# EAGLE design schema (EAGLE 7.3.0)
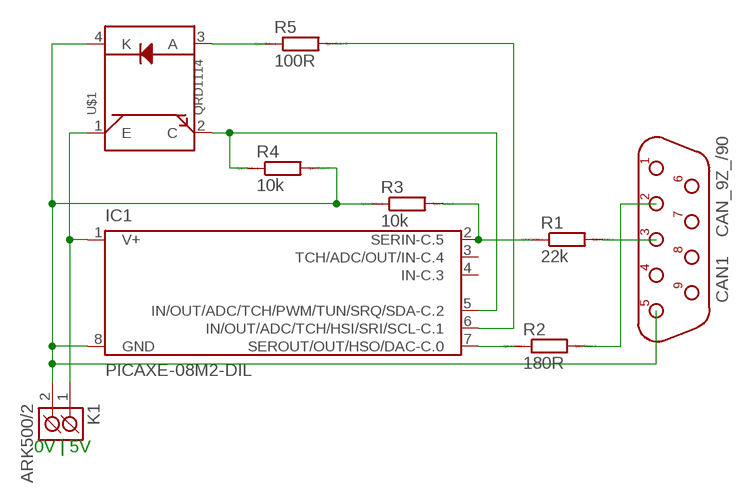
[diagram p0: schematic, sheet 1]

## Parts
CAN1  CAN_9Z_/90  [CAN9Z/90]
IC1  PICAXE-08M2-DIL  [DIL8]
K1  ARK500/2  [ARK500/2]
R1  22k  R0207/10  [0207/10]
R2  180R  R0207/10  [0207/10]
R3  10k  R0207/10  [0207/10]
R4  10k  R0207/10  [0207/10]
R5  100R  R0207/10  [0207/10]
U$1  QRD1114  [QRD1114]

## Nets
N$1: IC1.7(SEROUT/OUT/HSO/DAC-C.0) R2.1
N$2: CAN1.3 R1.2
N$3: CAN1.2 R2.2
N$4: R5.1 U$1.3(A)
N$5: IC1.6(IN/OUT/ADC/TCH/HSI/SRI/SCL-C.1) R5.2
N$6: IC1.5(IN/OUT/ADC/TCH/PWM/TUN/SRQ/SDA-C.2) R4.1 U$1.2(C)
N$7: CAN1.5 IC1.8(GND) K1.2(K2) R3.1 R4.2 U$1.4(K)
N$9: IC1.1(V+) K1.1(K1) U$1.1(E)
N$10: IC1.2(SERIN-C.5) R1.1 R3.2
Unconnected: CAN1.1 CAN1.4 CAN1.6 CAN1.7 CAN1.8 CAN1.9 IC1.3(TCH/ADC/OUT/IN-C.4) IC1.4(IN-C.3)

## Notes on the sheet
- 0V | 5V

## Library data of the parts
CAN1 = #PaJa_konektory:CAN_9Z: Konektory CANNON - zasuvka - 9pinu
IC1 = PICAXE:PICAXE-08M2: PICAXE chips come in two series – the M2 and X2 series – and 6 physical sizes (8, 14, 18, 20, 28, 40 pin). Feature 08M2 14M2 18M2 20M2 20X2 28X2 40X2 Memory Capacity(bytes) 2048 2048 x2 2048 x2 2048 x2 4096 4096 x4 4096 x4 RAM (bytes) 128 512 512 512 256 1280 1280 Byte Variables (bytes) 28 28 28 28 56 56 56 Input/Outputs Pins 6 12 16 18 18 22 33 ADC/Touch Pins 3 7 10 11 11 16 27 Max. Freq. (MHz) 32 32 32 32 64 64 64 Serial In/Out Yes Yes Yes Yes Yes Yes Yes Infrared In/Out Yes Yes Yes Yes Yes Yes Yes I2C Yes Yes Yes Yes Yes Yes Yes Tune (ring tones) Yes Yes Yes Yes Yes Yes Yes Parallel Tasks 4 8 8 8 1 1 1 Program Slots 1 2 2 2 1 4 4
K1 = #PaJa_konektory:ARK500/2: Svorkovnice - roztec 5mm - dvojita
R1-R5 = eagle-ltspice:R: RESISTOR, European symbol; SPICEMODEL: NONE; SPICEPREFIX: R
U$1 = SparkFun:QRD1114

## Board
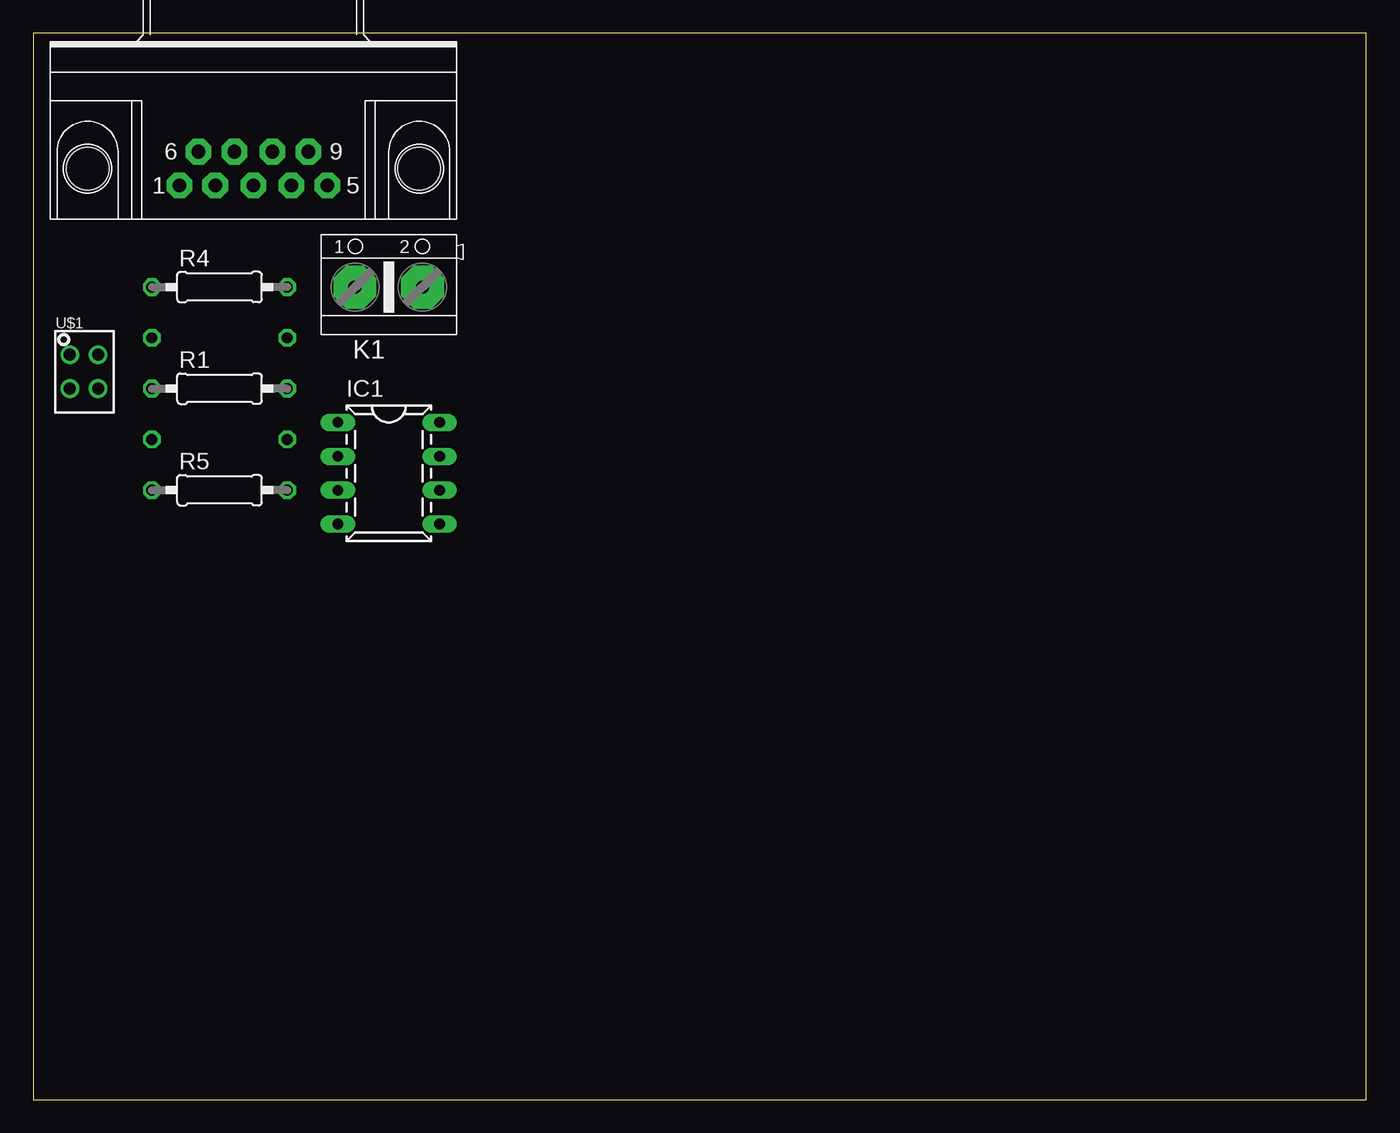
[diagram p1: board, top side]
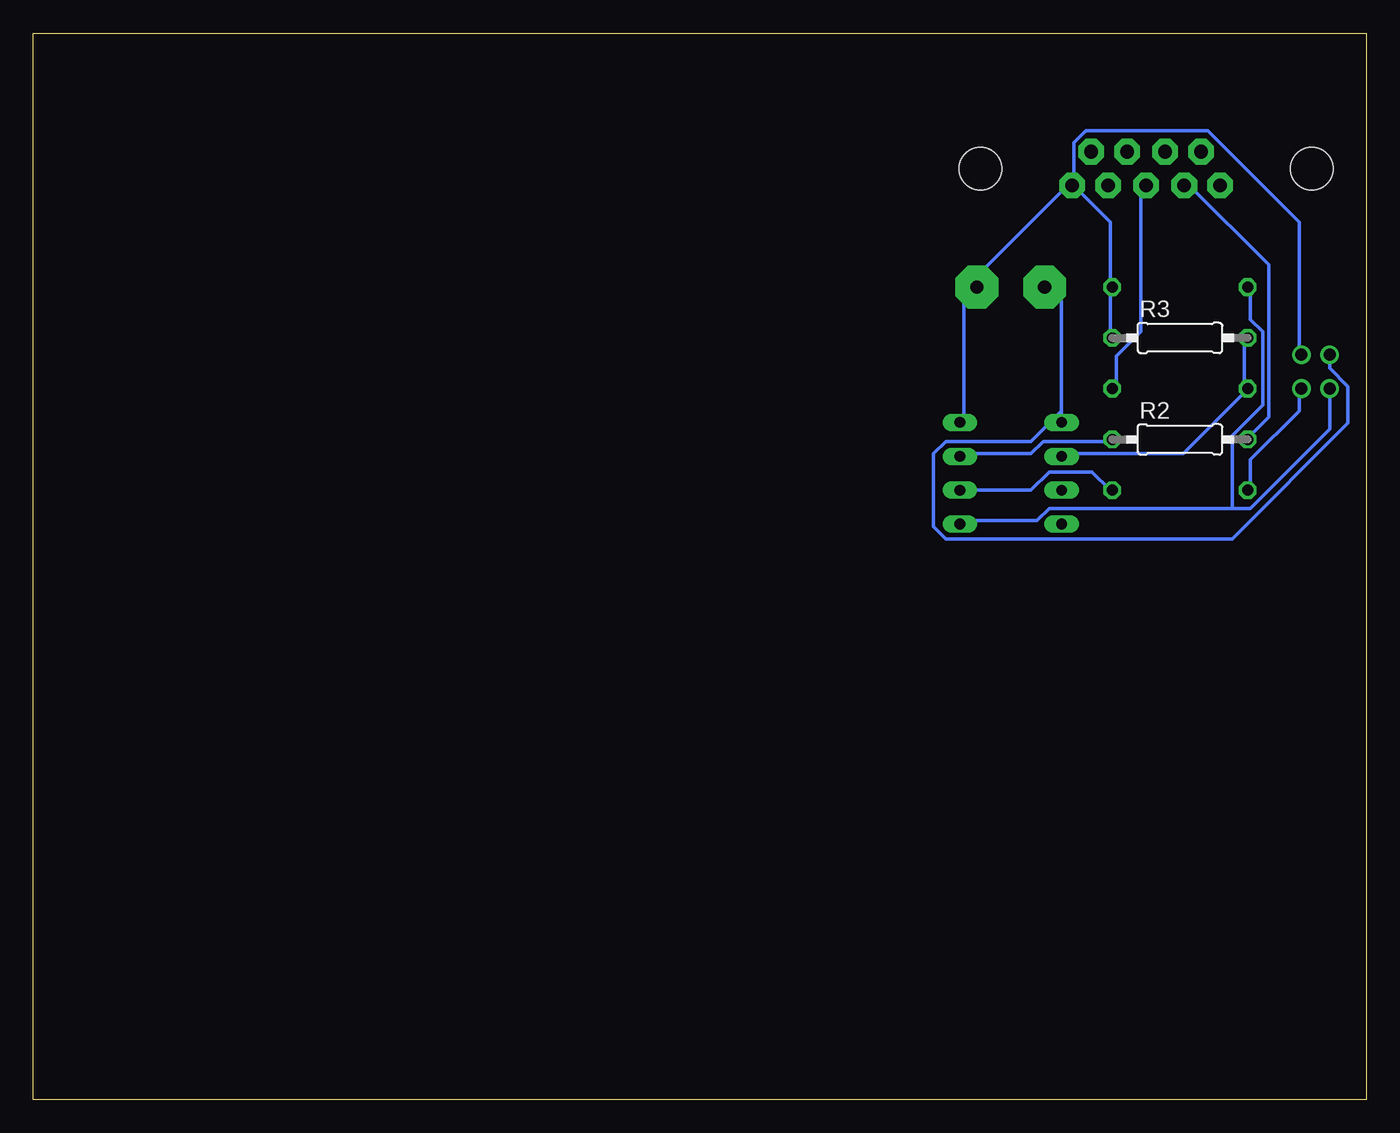
[diagram p2: board, bottom side, seen from below]

Size 100 x 80 mm. Coordinates in mm from the lower left corner, seen from the top.
Outline: 0,0 100,0 100,80 0,80 0,0
Copper layers (1*16): Top 0.035mm / dielectric 1.5mm / Bottom 0.035mm
Design rules "default": minimum track width 10mil, minimum drill 24mil, track to track 8mil, track to pad 8mil, pad to pad 8mil, via to via 8mil, smd to smd 8mil, copper to edge 40mil, drill to drill 8mil, minimum pad ring 10mil, minimum via ring 8mil, stop-mask expansion 4mil, vias tented up to drill 0mil, thermal gap 10mil

### Footprints (pad centres in the part's own frame; a part is rotated, then mirrored left to right if it is on the bottom)
CAN9Z/90 = drill 1.016 pad 1.93 octagon: 1 -5.556,0; 2 -2.857,0; 3 0,0; 4 2.857,0; 5 5.556,0; 6 -4.128,2.54; 7 -1.429,2.54; 8 1.429,2.54; 9 4.128,2.54 | hole 3.2: 12.446,1.27; -12.446,1.27
DIL8 = drill 0.8 pad 1.27 long: 1 -3.81,3.81; 2 -3.81,1.27; 3 -3.81,-1.27; 4 -3.81,-3.81; 5 3.81,-3.81; 6 3.81,-1.27; 7 3.81,1.27; 8 3.81,3.81
ARK500/2 = drill 1 pad 3.2 octagon: 1 -2.54,0; 2 2.54,0
0207/10 = drill 0.813 octagon: 1 -5.08,0; 2 5.08,0
QRD1114 = drill 0.9: 1 -1.067,1.27; 2 -1.067,-1.27; 3 1.041,-1.27; 4 1.041,1.27

### Placement (x,y rotation side)
CAN1  16.51,68.58 0 top
IC1  26.67,46.99 0 top
K1  26.67,60.96 0 top
R1  13.97,53.34 0 top
R2  13.97,49.53 0 bottom
R3  13.97,57.15 0 bottom
R4  13.97,60.96 0 top
R5  13.97,45.72 0 top
U$1  3.81,54.61 0 top

### Tracks (layer width: path | path; a pad name or v marks a point on that pad's centre or on a via)
N$1
  Bottom 0.254: IC1.7 30.18,48.46 25.15,48.46 24.23,49.38 19.2,49.38 R2.1
N$2
  Bottom 0.254: R1.2 18.75,53.49 18.75,55.78 16.92,57.61 16.92,68.58 CAN1.3
N$3
  Bottom 0.254: R2.2 8.69,49.84 7.32,51.21 7.32,62.64 13.26,68.58 CAN1.2
N$4
  Bottom 0.254: R5.1 8.69,45.72 8.69,48.01 5.03,51.66 5.03,53.03 U$1.3
N$5
  Bottom 0.254: IC1.6 25.15,45.72 23.77,47.09 20.57,47.09 19.2,45.72 R5.2
N$6
  Bottom 0.254: 10.06,44.35 8.69,44.35 2.74,50.29 U$1.2 | 10.06,44.35 23.77,44.35 24.69,43.43 30.18,43.43 IC1.5 | 10.06,44.35 10.06,49.84 7.77,52.12 7.77,57.61 8.69,58.52 8.69,60.81 R4.1
N$7
  Bottom 0.254: IC1.8 30.18,51.21 30.18,59.89 29.26,60.81 K1.2 28.8,61.27 28.8,62.18 22.4,68.58 CAN1.5 21.95,68.58 | R3.1 19.2,57.15 19.2,60.81 R4.2 19.2,61.27 19.2,65.84 21.95,68.58 | 21.95,68.58 21.95,71.78 21.03,72.69 11.89,72.69 5.03,65.84 5.03,56.24 U$1.4
N$9
  Bottom 0.254: 22.86,51.66 22.86,59.89 23.77,60.81 K1.1 | 22.86,51.66 IC1.1 | U$1.1 2.74,54.86 1.37,53.49 1.37,50.75 10.06,42.06 31.55,42.06 32.46,42.98 32.46,48.46 31.55,49.38 25.15,49.38 22.86,51.66
N$10
  Bottom 0.254: IC1.2 22.86,48.46 13.72,48.46 9.14,53.03 R1.1 9.14,53.49 9.14,57.15 R3.2